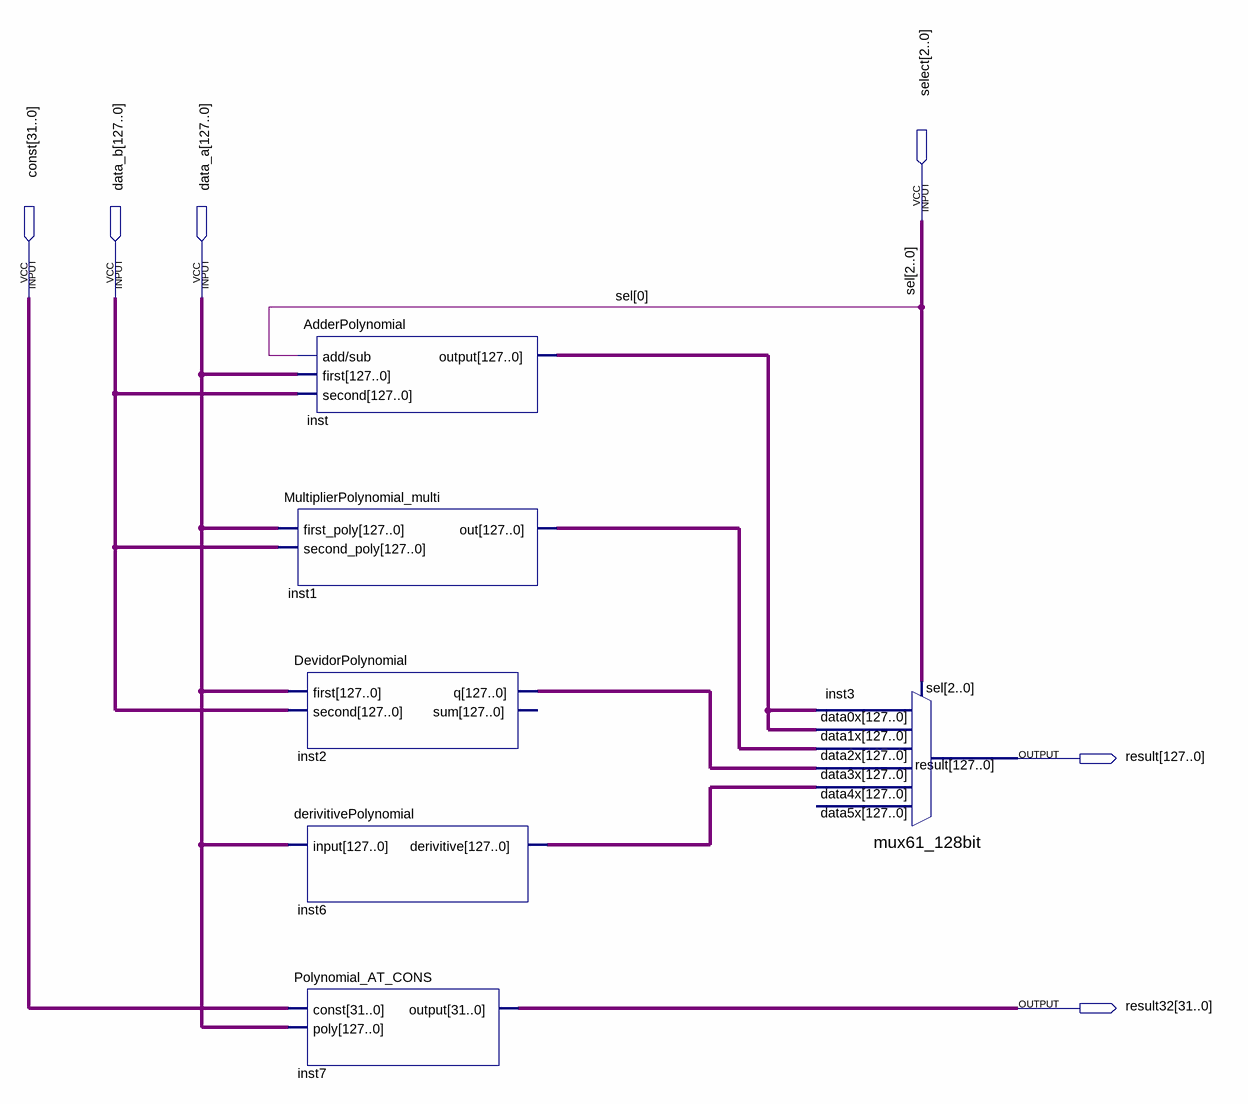
[diagram p0: schematic sheet]
// Quartus schematic CO_ALU.bdf as structural Verilog: 6 symbols, 6 pins
module CO_ALU (
  input  [2:0] select,
  input  [31:0] \const ,
  input  [127:0] data_b,
  input  [127:0] data_a,
  output [127:0] result,
  output [31:0] result32
);

  wire [127:0] inst1_out, inst2_q, inst6_derivitive, inst_output;

  MultiplierPolynomial_multi inst1 (.first_poly(data_a), .second_poly(data_b), .out(inst1_out));
  DevidorPolynomial inst2 (.first(data_a), .second(data_b), .q(inst2_q));  // open: sum
  derivitivePolynomial inst6 (.\input (data_a), .derivitive(inst6_derivitive));
  Polynomial_AT_CONS inst7 (.\const (\const ), .poly(data_a), .\output (result32));
  AdderPolynomial inst (.\add/sub (select[0]), .first(data_a), .second(data_b), .\output (inst_output));
  mux61_128bit inst3 (
    .data4x(inst6_derivitive), .data3x(inst2_q), .data2x(inst1_out), .data1x(inst_output),
    .data0x(inst_output), .sel(select), .result(result));  // open: data5x

  // Other names for the same wires on the sheet: sel[2:0] = select
endmodule
